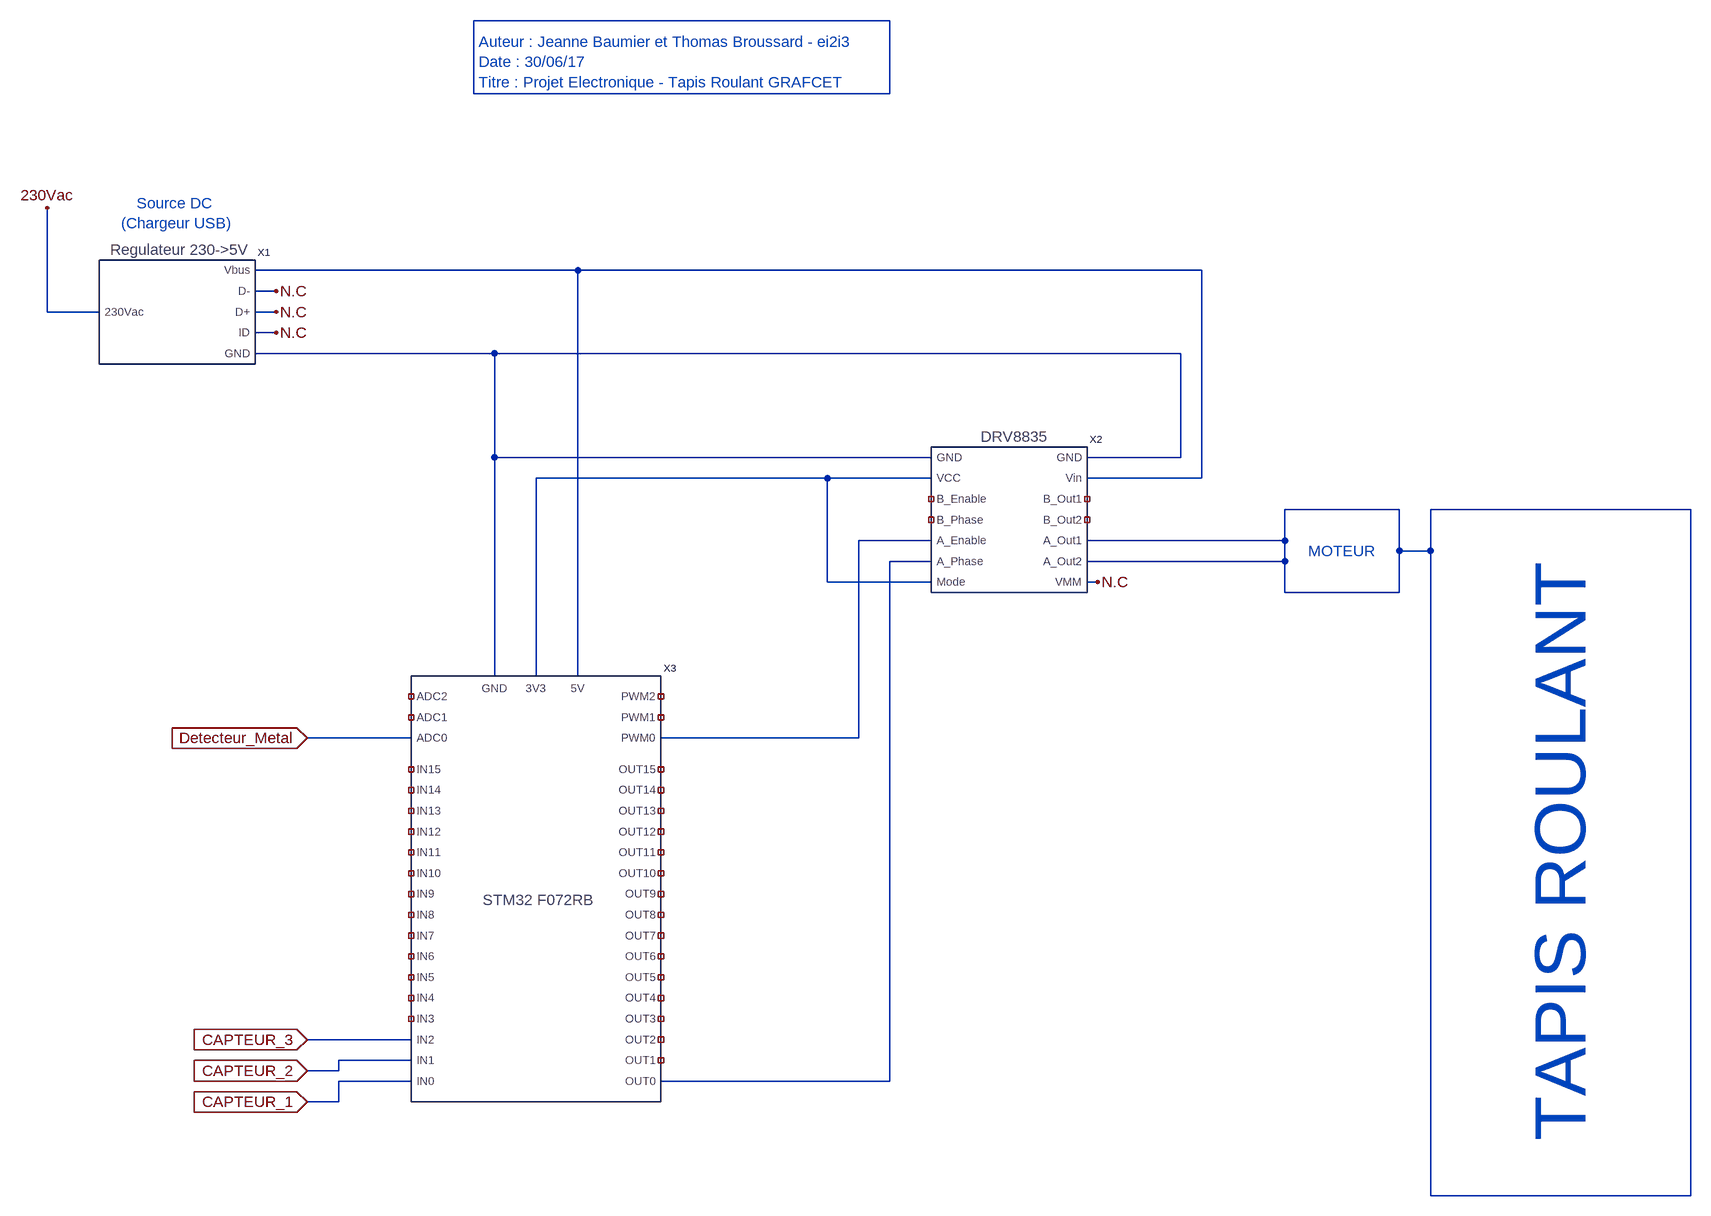
[diagram p0: schematic Schema_Complet.asc]
Schema_Complet.asc, the LTspice schematic file:
Version 4
SHEET 1 2212 1768
WIRE -272 -368 -912 -368
WIRE -912 -256 -912 -368
WIRE -272 -256 -272 -368
WIRE -272 -256 -912 -256
WIRE -752 16 -1248 16
WIRE 208 16 -752 16
WIRE -1216 48 -1248 48
WIRE -1568 80 -1568 -80
WIRE -1488 80 -1568 80
WIRE -1216 80 -1248 80
WIRE -1216 112 -1248 112
WIRE -880 144 -1248 144
WIRE 176 144 -880 144
WIRE -880 304 -880 144
WIRE -208 304 -880 304
WIRE 176 304 176 144
WIRE 176 304 32 304
WIRE -368 336 -816 336
WIRE -208 336 -368 336
WIRE 208 336 208 16
WIRE 208 336 32 336
WIRE 512 384 336 384
WIRE 960 384 560 384
WIRE -208 432 -320 432
WIRE 336 432 336 384
WIRE 336 432 32 432
WIRE 512 448 512 384
WIRE 560 448 560 384
WIRE 560 448 512 448
WIRE -208 464 -272 464
WIRE 336 464 336 432
WIRE 336 464 32 464
WIRE -368 496 -368 336
WIRE -208 496 -368 496
WIRE 48 496 32 496
WIRE 336 512 336 464
WIRE 512 512 512 448
WIRE 512 512 336 512
WIRE -880 640 -880 304
WIRE -816 640 -816 336
WIRE -752 640 -752 16
WIRE -1008 736 -1168 736
WIRE -320 736 -320 432
WIRE -320 736 -624 736
WIRE -1008 1200 -1168 1200
WIRE -1008 1232 -1120 1232
WIRE -1120 1248 -1120 1232
WIRE -1120 1248 -1168 1248
WIRE -1008 1264 -1120 1264
WIRE -272 1264 -272 464
WIRE -272 1264 -624 1264
WIRE -1120 1296 -1120 1264
WIRE -1120 1296 -1168 1296
WIRE 560 1440 560 448
WIRE 960 1440 960 384
WIRE 960 1440 560 1440
FLAG 48 496 N.C
FLAG -1568 -80 230Vac
FLAG -1216 112 N.C
FLAG -1216 80 N.C
FLAG -1216 48 N.C
FLAG -1168 1296 CAPTEUR_1
IOPIN -1168 1296 In
FLAG -1168 1248 CAPTEUR_2
IOPIN -1168 1248 In
FLAG -1168 1200 CAPTEUR_3
IOPIN -1168 1200 In
FLAG -1168 736 Detecteur_Metal
IOPIN -1168 736 In
SYMBOL Source_DC_5V_USB -1392 32 R0
SYMATTR InstName X1
SYMBOL DRV8835 -160 336 R0
SYMATTR InstName X2
SYMBOL Microcontroleur -704 1120 R0
SYMATTR InstName X3
TEXT -1368 -72 Center 2 ;Source DC \n(Chargeur USB)
TEXT -904 -336 Left 2 ;Auteur : Jeanne Baumier et Thomas Broussard - ei2i3\nDate : 30/06/17\nTitre : Projet Electronique - Tapis Roulant GRAFCET
TEXT 424 448 Center 2 ;MOTEUR
TEXT 760 912 VCenter 7 ;TAPIS ROULANT

The netlist it stands for:
* Schema_Complet.asc
XX1 N002 N003 230Vac N.C N.C N.C Source_DC_5V_USB  ; pins Vbus GND 230Vac D- D+ ID
XX2 N003 N004 NC_01 NC_02 N006 N007 N004 N003 N002 NC_03 NC_04 N005 N005 N.C DRV8835  ; pins GND VCC B_Enable B_Phase A_Enable A_Phase Mode GND Vin B_Out1 B_Out2 A_Out1 A_Out2 VMM
XX3 N007 CAPTEUR_1 CAPTEUR_2 CAPTEUR_3 NC_05 NC_06 NC_07 NC_08 NC_09 NC_10 NC_11 NC_12 NC_13 NC_14 NC_15 NC_16 NC_17 NC_18 NC_19 NC_20 NC_21 NC_22 NC_23 NC_24 NC_25 NC_26 NC_27 NC_28 NC_29 NC_30 NC_31 NC_32 Detecteur_Metal NC_33 NC_34 N006 NC_35 NC_36 N003 N004 N002 Microcontroleur  ; pins OUT0 IN0 IN1 IN2 IN3 IN4 IN5 IN6 IN7 IN8 IN9 IN10 OUT1 OUT2 OUT3 OUT4 OUT5 OUT6 OUT7 OUT8 OUT9 OUT10 IN11 IN12 IN13 IN14 IN15 OUT11 OUT12 OUT13 OUT14 OUT15 ADC0 ADC1 ADC2 PWM0 PWM1 PWM2 GND 3V3 5V
* Source DC
* (Chargeur USB)
* Auteur : Jeanne Baumier et Thomas Broussard - ei2i3
* Date : 30/06/17
* Titre : Projet Electronique - Tapis Roulant GRAFCET
* MOTEUR
* TAPIS ROULANT
.backanno
.end